# Altium schematic sheet Serial.SchDoc: Iris
size A3; Organization: Toradex AG; Address1: Altsagenstrasse 5; Address2: Horw; Address3: 6048; Address4: Switzerland; DocumentNumber: 14; Revision: V2.0; SheetNumber: 14; SheetTotal: 16
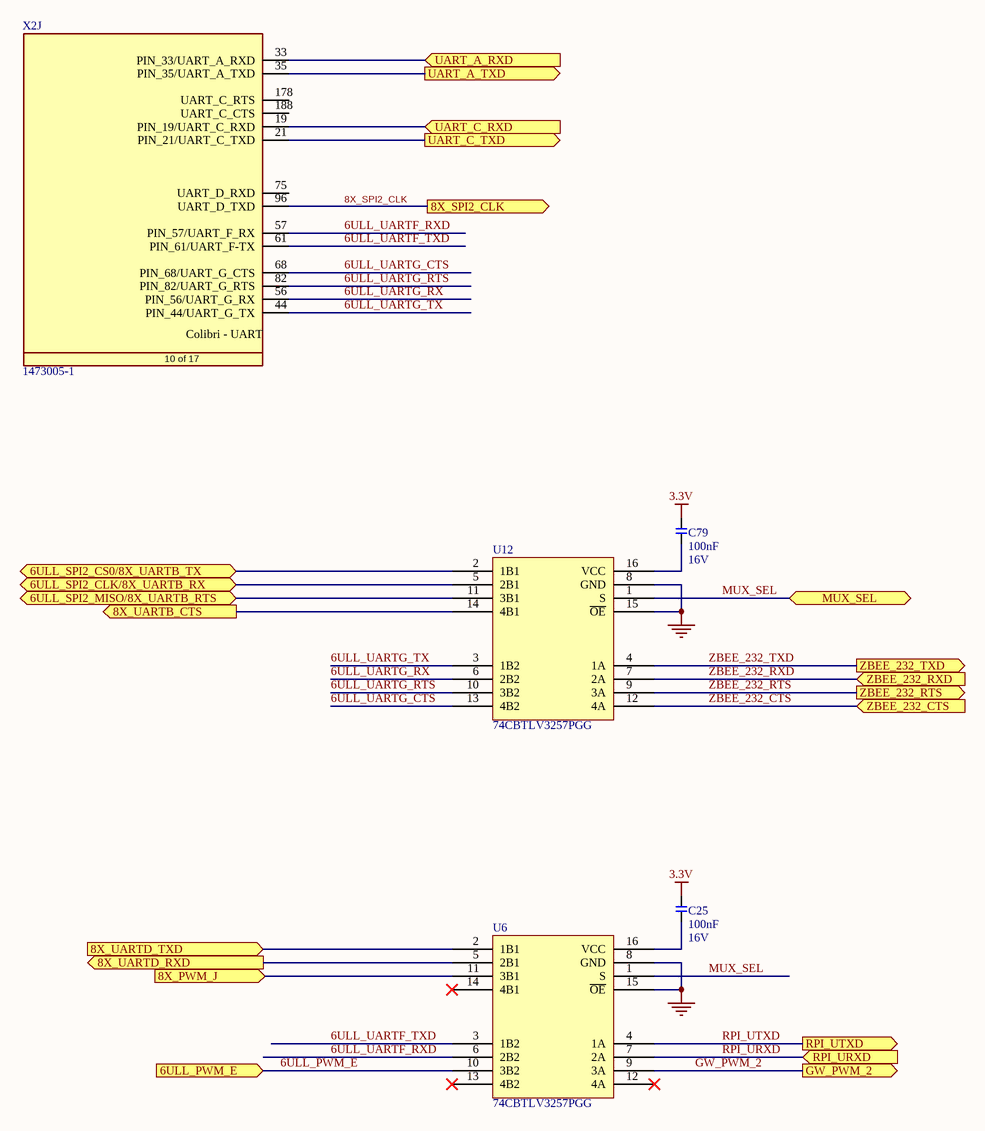
[diagram p0: Serial.SchDoc]

## Parts
C25  Rating: 16V  [T_CAPC0603X33N]  (hidden comment: 100nF)
C79  Rating: 16V  [T_CAPC0603X33N]  (hidden comment: 100nF)
U6  74CBTLV3257PGG  [SOP65P640X120-16N]
U12  74CBTLV3257PGG  [SOP65P640X120-16N]
X2  1473005-1  [T_Tyco_1473005-1]  (part J of 17)

## Ports
6ULL_PWM_E (in), 6ULL_SPI2_CLK/8X_UARTB_RX (bidir), 6ULL_SPI2_CS0/8X_UARTB_TX (bidir), 6ULL_SPI2_MISO/8X_UARTB_RTS (bidir), 8X_PWM_J (in), 8X_SPI2_CLK (out), 8X_UARTB_CTS (out), 8X_UARTD_RXD (out), 8X_UARTD_TXD (in), GW_PWM_2 (out), MUX_SEL (bidir), RPI_URXD (in), RPI_UTXD (out), UART_A_RXD (in), UART_A_TXD (out), UART_C_RXD (in), UART_C_TXD (out), ZBEE_232_CTS (in), ZBEE_232_RTS (out), ZBEE_232_RXD (in), ZBEE_232_TXD (out)

## Nets
3.3V: C25.2 C79.2
GND: U6.8(GND) U6.15(~{OE}) U12.8(GND) U12.15(~{OE})
6ULL_PWM_E: U6.10(3B2) ; port 6ULL_PWM_E
6ULL_SPI2_CLK/8X_UARTB_RX: U12.5(2B1) ; port 6ULL_SPI2_CLK/8X_UARTB_RX
6ULL_SPI2_CS0/8X_UARTB_TX: U12.2(1B1) ; port 6ULL_SPI2_CS0/8X_UARTB_TX
6ULL_SPI2_MISO/8X_UARTB_RTS: U12.11(3B1) ; port 6ULL_SPI2_MISO/8X_UARTB_RTS
6ULL_UARTF_RXD: U6.6(2B2) X2.57(PIN_57/UART_F_RX)
6ULL_UARTF_TXD: U6.3(1B2) X2.61(PIN_61/UART_F-TX)
6ULL_UARTG_CTS: U12.13(4B2) X2.68(PIN_68/UART_G_CTS)
6ULL_UARTG_RTS: U12.10(3B2) X2.82(PIN_82/UART_G_RTS)
6ULL_UARTG_RX: U12.6(2B2) X2.56(PIN_56/UART_G_RX)
6ULL_UARTG_TX: U12.3(1B2) X2.44(PIN_44/UART_G_TX)
8X_PWM_J: U6.11(3B1) ; port 8X_PWM_J
8X_SPI2_CLK: X2.96(UART_D_TXD) ; port 8X_SPI2_CLK
8X_UARTB_CTS: U12.14(4B1) ; port 8X_UARTB_CTS
8X_UARTD_RXD: U6.5(2B1) ; port 8X_UARTD_RXD
8X_UARTD_TXD: U6.2(1B1) ; port 8X_UARTD_TXD
GW_PWM_2: U6.9(3A) ; port GW_PWM_2
MUX_SEL: U6.1(S) U12.1(S) ; port MUX_SEL
RPI_URXD: U6.7(2A) ; port RPI_URXD
RPI_UTXD: U6.4(1A) ; port RPI_UTXD
UART_A_RXD: X2.33(PIN_33/UART_A_RXD) ; port UART_A_RXD
UART_A_TXD: X2.35(PIN_35/UART_A_TXD) ; port UART_A_TXD
UART_C_RXD: X2.19(PIN_19/UART_C_RXD) ; port UART_C_RXD
UART_C_TXD: X2.21(PIN_21/UART_C_TXD) ; port UART_C_TXD
ZBEE_232_CTS: U12.12(4A) ; port ZBEE_232_CTS
ZBEE_232_RTS: U12.9(3A) ; port ZBEE_232_RTS
ZBEE_232_RXD: U12.7(2A) ; port ZBEE_232_RXD
ZBEE_232_TXD: U12.4(1A) ; port ZBEE_232_TXD
NetC25_1: C25.1 U6.16(VCC)
NetC79_1: C79.1 U12.16(VCC)

Not connected (* = marked no-connect by the designer): U6 12(4A)* 13(4B2)* 14(4B1)*; X2 75(UART_D_RXD) 178(UART_C_RTS) 188(UART_C_CTS)

## Notes on the sheet
- Title
- Size:
- Date:
- A3
- Number:
- Time:
- Revision:
- Sheet
- of
- File:
- (in symbol CON-Tyco-1473005-1-200-0.6mm, part J) Colibri - UART; 10 of 17

## Library data of the parts
C25 C79 = C-X7R-100nF-16V-10%-0603: Capacitor Ceramic X7R 100nF 16V 10% 0603; Tolerance: 10%; Type: X7R; Value: 100nF
X2 = CON-Tyco-1473005-1-200-0.6mm: SODIMM Connector; Manufacturer Name: Tyco; No. of ways: 200; Manufacturer Part No.: 1473005-1